# Altium schematic sheet STM-Board-v1.0.SchDoc
size 454 x 193 mm; Date: 10.02.2021; ApprovedBy: Еремеев И.М.; CheckedBy: Ямщиков А.В.; Author: Мухарялмов И.Г.; CompanyName: ООО "Промобот"; City: г.Пермь,; Mail: mig@promo-bot.ru; Project Version: RoboC 0.8.2; Project: RoboC; Document: Принципиальная схема; Hardware version: 0.8
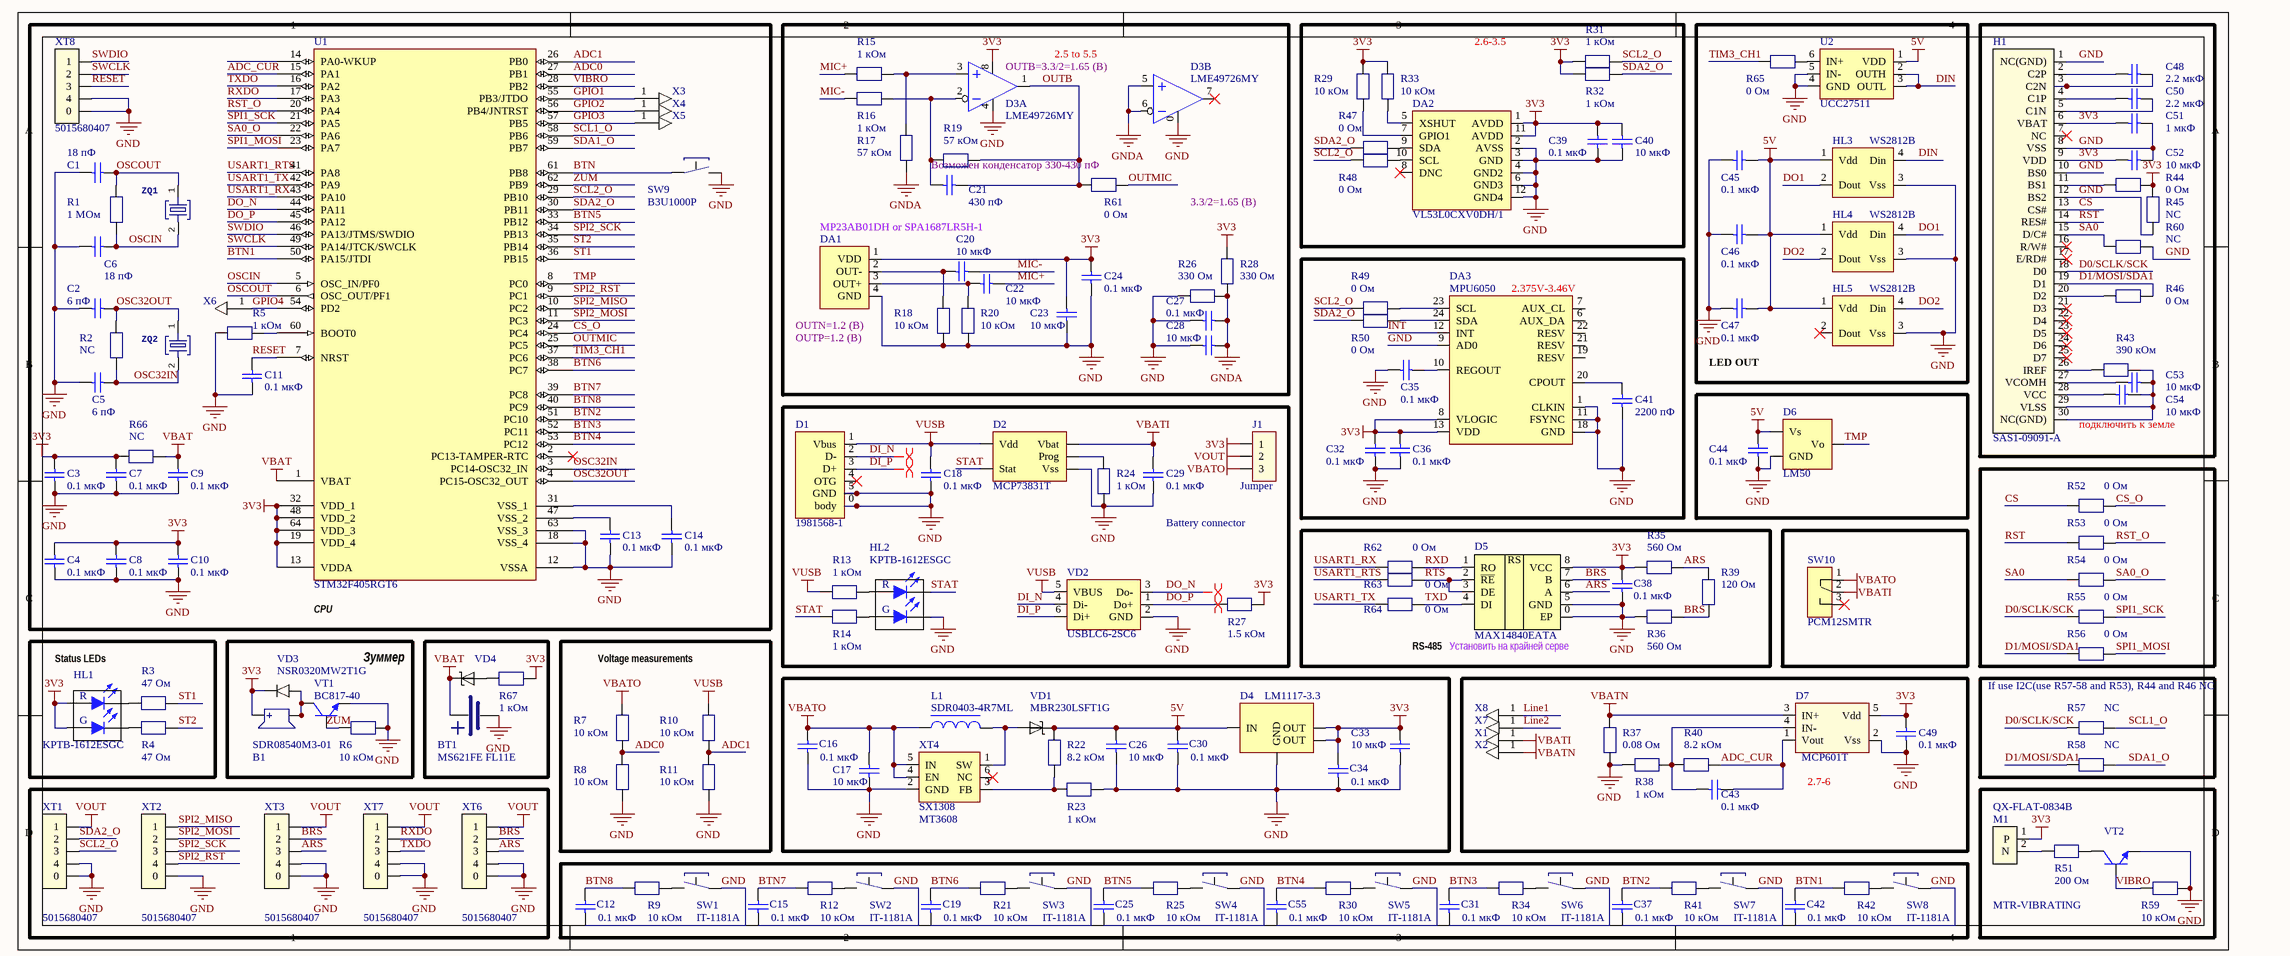
[diagram p0: STM-Board-v1.0.SchDoc]

## Parts
B1  SDR08540M3-01  [SDR08540M3-01]
BT1  MS621FE FL11E  [MS621FE FL11E]
C1  value 18 пФ  [C0402]  (hidden comment: Capacitor)
C2  value 6 пФ  [C0402]  (hidden comment: Capacitor)
C3  value 0.1 мкФ  [C0402]  (hidden comment: Capacitor)
C4  value 0.1 мкФ  [C0402]  (hidden comment: Capacitor)
C5  value 6 пФ  [C0402]  (hidden comment: Capacitor)
C6  value 18 пФ  [C0402]  (hidden comment: Capacitor)
C7  value 0.1 мкФ  [C0402]  (hidden comment: Capacitor)
C8  value 0.1 мкФ  [C0402]  (hidden comment: Capacitor)
C9  value 0.1 мкФ  [C0402]  (hidden comment: Capacitor)
C10  value 0.1 мкФ  [C0402]  (hidden comment: Capacitor)
C11  value 0.1 мкФ  [C0402]  (hidden comment: Capacitor)
C12  value 0.1 мкФ  [C0402]  (hidden comment: Capacitor)
C13  value 0.1 мкФ  [C0402]  (hidden comment: Capacitor)
C14  value 0.1 мкФ  [C0402]  (hidden comment: Capacitor)
C15  value 0.1 мкФ  [C0402]  (hidden comment: Capacitor)
C16  value 0.1 мкФ  [C0402]  (hidden comment: Capacitor)
C17  value 10 мкФ  [1206]  (hidden comment: Capacitor)
C18  value 0.1 мкФ  [C0402]  (hidden comment: Capacitor)
C19  value 0.1 мкФ  [C0402]  (hidden comment: Capacitor)
C20  value 10 мкФ  [C0402]  (hidden comment: Capacitor)
C21  value 430 пФ  [C0402]  (hidden comment: Capacitor)
C22  value 10 мкФ  [C0402]  (hidden comment: Capacitor)
C23  value 10 мкФ  [C0402]  (hidden comment: Capacitor)
C24  value 0.1 мкФ  [C0402]  (hidden comment: Capacitor)
C25  value 0.1 мкФ  [C0402]  (hidden comment: Capacitor)
C26  value 10 мкФ  [1206]  (hidden comment: Capacitor)
C27  value 0.1 мкФ  [C0402]  (hidden comment: Capacitor)
C28  value 10 мкФ  [C0402]  (hidden comment: Capacitor)
C29  value 0.1 мкФ  [C0402]  (hidden comment: Capacitor)
C30  value 0.1 мкФ  [C0402]  (hidden comment: Capacitor)
C31  value 0.1 мкФ  [C0402]  (hidden comment: Capacitor)
C32  value 0.1 мкФ  [C0402]  (hidden comment: Capacitor)
C33  value 10 мкФ  [1206]  (hidden comment: Capacitor)
C34  value 0.1 мкФ  [C0402]  (hidden comment: Capacitor)
C35  value 0.1 мкФ  [C0402]  (hidden comment: Capacitor)
C36  value 0.1 мкФ  [C0402]  (hidden comment: Capacitor)
C37  value 0.1 мкФ  [C0402]  (hidden comment: Capacitor)
C38  value 0.1 мкФ  [C0402]  (hidden comment: Capacitor)
C39  value 0.1 мкФ  [C0402]  (hidden comment: Capacitor)
C40  value 10 мкФ  [C0402]  (hidden comment: Capacitor)
C41  value 2200 пФ  [C0402]  (hidden comment: Capacitor)
C42  value 0.1 мкФ  [C0402]  (hidden comment: Capacitor)
C43  value 0.1 мкФ  [C0402]  (hidden comment: Capacitor)
C44  value 0.1 мкФ  [C0402]  (hidden comment: Capacitor)
C45  value 0.1 мкФ  [C0402]  (hidden comment: Capacitor)
C46  value 0.1 мкФ  [C0402]  (hidden comment: Capacitor)
C47  value 0.1 мкФ  [C0402]  (hidden comment: Capacitor)
C48  value 2.2 мкФ  [C0402]  (hidden comment: Capacitor)
C49  value 0.1 мкФ  [C0402]  (hidden comment: Capacitor)
C50  value 2.2 мкФ  [C0402]  (hidden comment: Capacitor)
C51  value 1 мкФ  [C0402]  (hidden comment: Capacitor)
C52  value 10 мкФ  [C0402]  (hidden comment: Capacitor)
C53  value 10 мкФ  [C0402]  (hidden comment: Capacitor)
C54  value 10 мкФ  [C0402]  (hidden comment: Capacitor)
C55  value 0.1 мкФ  [C0402]  (hidden comment: Capacitor)
D1  1981568-1  [MicroUSB-B]
D2  MCP73831T  [SOT23-5]
D3  value LME49726MY  [MSOP8 - PP]  (hidden comment: Audio Operational Amplifier)  (parts A,B of 2)
D4  LM1117-3.3  [SOT223]
D5  MAX14840EATA  [TDFN-8]
D6  value LM50  [SOT-23]  (hidden comment: Датчик температуры)
D7  value MCP601T  [SOT23-5]  (hidden comment: Операционный усилитель)
DA1  MP23AB01DH or SPA1687LR5H-1  [MP23AB01DH]
DA2  value VL53L0CXV0DH/1  [VL53L0X - big]  (hidden comment: ИК датчик VL53L0X)
DA3  value MPU6050  [MPU-6050]  (hidden comment: Гироскоп)
H1  value SAS1-09091-A  [OLED 1.3 128x64]  (hidden comment: OLED DIsp 1.3 128x64)
HL1  KPTB-1612ESGC  [LED_1.6x1.25]
HL2  KPTB-1612ESGC  [LED_1.6x1.25]
HL3  WS2812B  [WS2812B_N]
HL4  WS2812B  [WS2812B_N]
HL5  WS2812B  [WS2812B_N]
J1  value Jumper  [Jumper_3]  (hidden comment: Jumper_2)
L1  SDR0403-4R7ML  [SDR0403]
M1  QX-FLAT-0834B  [QX-FLAT-0834B]
R1  value 1 МОм  [R0402]  (hidden comment: Чип резистор)
R2  value NC  [R0402]  (hidden comment: Чип резистор)
R3  value 47 Ом  [R0402]  (hidden comment: Чип резистор 0402)
R4  value 47 Ом  [R0402]  (hidden comment: Чип резистор 0402)
R5  value 1 кОм  [R0402]  (hidden comment: Чип резистор)
R6  value 10 кОм  [R0402]  (hidden comment: Чип резистор)
R7  value 10 кОм  [R0402]  (hidden comment: Чип резистор)
R8  value 10 кОм  [R0402]  (hidden comment: Чип резистор)
R9  value 10 кОм  [R0402]  (hidden comment: Чип резистор)
R10  value 10 кОм  [R0402]  (hidden comment: Чип резистор)
R11  value 10 кОм  [R0402]  (hidden comment: Чип резистор)
R12  value 10 кОм  [R0402]  (hidden comment: Чип резистор)
R13  1 кОм  [R0402]
R14  1 кОм  [R0402]
R15  value 1 кОм  [R0402]  (hidden comment: Чип резистор)
R16  value 1 кОм  [R0402]  (hidden comment: Чип резистор)
R17  value 57 кОм  [R0402]  (hidden comment: Чип резистор)
R18  value 10 кОм  [R0402]  (hidden comment: Чип резистор)
R19  value 57 кОм  [R0402]  (hidden comment: Чип резистор)
R20  value 10 кОм  [R0402]  (hidden comment: Чип резистор)
R21  value 10 кОм  [R0402]  (hidden comment: Чип резистор)
R22  8.2 кОм  [R0402]
R23  1 кОм  [R0402]
R24  value 1 кОм  [R0402]  (hidden comment: Чип резистор)
R25  value 10 кОм  [R0402]  (hidden comment: Чип резистор)
R26  value 330 Ом  [R0402]  (hidden comment: Чип резистор)
R27  value 1.5 кОм  [R0402]  (hidden comment: Чип резистор)
R28  value 330 Ом  [R0402]  (hidden comment: Чип резистор)
R29  value 10 кОм  [R0402]  (hidden comment: Чип резистор)
R30  value 10 кОм  [R0402]  (hidden comment: Чип резистор)
R31  value 1 кОм  [R0402]  (hidden comment: Чип резистор)
R32  value 1 кОм  [R0402]  (hidden comment: Чип резистор)
R33  value 10 кОм  [R0402]  (hidden comment: Чип резистор)
R34  value 10 кОм  [R0402]  (hidden comment: Чип резистор)
R35  value 560 Ом  [R0402]  (hidden comment: Чип резистор)
R36  value 560 Ом  [R0402]  (hidden comment: Чип резистор)
R37  value 0.08 Ом  [P1206]  (hidden comment: Чип резистор)
R38  value 1 кОм  [R0402]  (hidden comment: Чип резистор)
R39  value 120 Ом  [R0402]  (hidden comment: Чип резистор)
R40  value 8.2 кОм  [R0402]  (hidden comment: Чип резистор)
R41  value 10 кОм  [R0402]  (hidden comment: Чип резистор)
R42  value 10 кОм  [R0402]  (hidden comment: Чип резистор)
R43  value 390 кОм  [R0402]  (hidden comment: Чип резистор)
R44  value 0 Ом  [R0402]  (hidden comment: Чип резистор)
R45  value NC  [R0402]  (hidden comment: Чип резистор)
R46  value 0 Ом  [R0402]  (hidden comment: Чип резистор)
R47  value 0 Ом  [R0402]  (hidden comment: Чип резистор)
R48  value 0 Ом  [R0402]  (hidden comment: Чип резистор)
R49  value 0 Ом  [R0402]  (hidden comment: Чип резистор)
R50  value 0 Ом  [R0402]  (hidden comment: Чип резистор)
R51  value 200 Ом  [R0402]  (hidden comment: Чип резистор)
R52  value 0 Ом  [R0402]  (hidden comment: Чип резистор)
R53  value 0 Ом  [R0402]  (hidden comment: Чип резистор)
R54  value 0 Ом  [R0402]  (hidden comment: Чип резистор)
R55  value 0 Ом  [R0402]  (hidden comment: Чип резистор)
R56  value 0 Ом  [R0402]  (hidden comment: Чип резистор)
R57  value NC  [R0402]  (hidden comment: Чип резистор)
R58  value NC  [R0402]  (hidden comment: Чип резистор)
R59  value 10 кОм  [R0402]  (hidden comment: Чип резистор)
R60  value NC  [R0402]  (hidden comment: Чип резистор)
R61  value 0 Ом  [R0402]  (hidden comment: Чип резистор)
R62  value 0 Ом  [R0402]  (hidden comment: Чип резистор)
R63  value 0 Ом  [R0402]  (hidden comment: Чип резистор)
R64  value 0 Ом  [R0402]  (hidden comment: Чип резистор)
R65  value 0 Ом  [R0402]  (hidden comment: Чип резистор)
R66  value NC  [R0402]  (hidden comment: Чип резистор)
R67  value 1 кОм  [R0402]  (hidden comment: Чип резистор)
SW1  IT-1181A  [SWT-1]
SW2  IT-1181A  [SWT-1]
SW3  IT-1181A  [SWT-1]
SW4  IT-1181A  [SWT-1]
SW5  IT-1181A  [SWT-1]
SW6  IT-1181A  [SWT-1]
SW7  IT-1181A  [SWT-1]
SW8  IT-1181A  [SWT-1]
SW9  B3U1000P  [B3U1000P]
SW10  PCM12SMTR  [PCM12SMTR]
U1  value STM32F405RGT6  [LQFP64_L]  (hidden comment: STM32F302RCT6)
U2  UCC27511  [SOT23-6]
VD1  MBR230LSFT1G  [SOD-123]
VD2  USBLC6-2SC6  [SOT23-6]
VD3  NSR0320MW2T1G  [SOD-323]
VD4  NSR0320MW2T1G  [SOD-323]  (value not drawn)
VT1  ВС817-40  [SOT-23]
VT2  ВС817-40  [SOT-23]  (value not drawn)
X1  (no value)  [PAD_1X2]
X2  (no value)  [PAD_1X2]
X3  (no value)  [Pad_R2]
X4  (no value)  [Pad_R2]
X5  (no value)  [Pad_R2]
X6  (no value)  [Pad_R2]
X7  (no value)  [Pad_R2]
X8  (no value)  [Pad_R2]
XT1  5015680407  [5015680407]
XT2  5015680407  [5015680407]
XT3  5015680407  [5015680407]
XT4  SX1308  [SOT23-6]
XT6  5015680407  [5015680407]
XT7  5015680407  [5015680407]
XT8  5015680407  [5015680407]
ZQ1  ABM3-8.000MHZ-D2Y-T  [ABM3]  (value not drawn)
ZQ2  ABS07-120-32.768KHZ-T  [ABS07]  (value not drawn)

## Blocks framed on the sheet
CPU: C1-C11 C13 C14 R1 R2 R5 R66 SW9 U1 X3-X6 XT8 ZQ1 ZQ2
2.6-3.5: C39 C40 DA2 R29 R31-R33 R47 R48
LED OUT: C45-C47 HL3-HL5 R65 U2
подключить к земле: C48 C50-C54 H1 R43-R46 R60
2.375V-3.46V: C32 C35 C36 C41 DA3 R49 R50
Battery connector: C18 C29 D1 D2 HL2 J1 R13 R14 R24 R27 VD2
Status LEDs: HL1 R3 R4
Зуммер: B1 R6 VD3 VT1
Voltage measurements: R7 R8 R10 R11
MT3608: C16 C17 C26 C30 C33 C34 D4 L1 R22 R23 VD1 XT4
2.7-6: C43 C49 D7 R37 R38 R40 X1 X2 X7 X8
If use I2C(use R57-58 and R53), R44 and R46 NC: R57 R58
MTR-VIBRATING: M1 R51 R59 VT2

## Nets
3V3: B1.1(+) C3.1 C4.1 C7.1 C8.1 C10.1 C23.2 C24.2 C32.1 C33.2 C34.2 C36.1 C38.2 C39.1 C40.1 C49.1 C51.1 C52.1 D3.8(Vcc) D4.2(OUT) D4.4(OUT) D5.8(VCC) D7.5(Vdd) DA1.1(VDD) DA2.1(AVDD) DA2.11(AVDD) DA3.8(VLOGIC) DA3.13(VDD) H1.6(VBAT) H1.9(VDD) HL1.1(A) HL1.3(A) J1.1 M1.1(P) R27.2 R28.2 R29.2 R31.2 R32.2 R33.2 R35.2 R44.1 R45.1 R66.1 R67.1 U1.13(VDDA) U1.19(VDD_4) U1.32(VDD_1) U1.48(VDD_2) U1.64(VDD_3) VD3.1(K)
5V: C26.2 C30.2 C44.1 C45.2 C46.2 C47.2 D4.3(IN) D6.1(Vs) HL3.1(Vdd) HL4.1(Vdd) HL5.1(Vdd) R22.1 U2.1(VDD) VD1.1(K)
GND: BT1.2(-) C1.1 C2.1 C3.2 C4.2 C5.1 C6.1 C7.2 C8.2 C9.2 C10.2 C11.2 C12.1 C13.2 C14.2 C15.1 C16.1 C17.1 C18.1 C19.1 C23.1 C24.1 C25.1 C26.1 C27.2 C28.2 C29.1 C30.1 C31.1 C32.2 C33.1 C34.1 C35.1 C36.2 C37.1 C38.1 C39.2 C40.2 C41.2 C42.1 C44.2 C45.1 C46.1 C47.1 C49.2 C51.2 C52.2 C55.1 D1.0(body) D1.5(GND) D2.2(Vss) D3.0(PP) D3.4(GND) D4.1(GND) D5.0(EP) D5.5(GND) D6.3(GND) D7.2(Vss) DA1.4(GND) DA2.2(AVSS) DA2.3(GND) DA2.4(GND2) DA2.6(GND3) DA2.12(GND4) DA3.1(CLKIN) DA3.9(AD0) DA3.11(FSYNC) DA3.18(GND) H1.1(NC(GND)) H1.8(VSS) H1.10(BS0) H1.12(BS2) HL2.4(C) HL3.3(Vss) HL4.3(Vss) HL5.3(Vss) R5.2 R6.1 R8.2 R11.2 R18.2 R20.2 R23.2 R24.1 R26.1 R36.2 R37.2 R38.2 R45.2 R59.2 R60.1 SW1.1 SW2.1 SW3.1 SW4.1 SW5.1 SW6.1 SW7.1 SW8.1 SW9.2 U1.12(VSSA) U1.18(VSS_4) U1.63(VSS_3) U2.4(GND) U2.5(IN-) VD2.2(GND) VT1.2(E) VT2.2(E) XT1.0 XT1.4 XT2.0 XT3.0 XT3.4 XT4.2(GND) XT6.0 XT6.4 XT7.0 XT7.4 XT8.0 XT8.4
GNDA: C27.1 C28.1 D3.5(2IN+) D3.6(2IN-) R17.1 R26.2 R28.1
VBAT: BT1.1(+) C9.1 R66.2 U1.1(VBAT) VD4.1(K)
VBATI: C29.2 D2.3(Vbat) SW10.2 X1.1
VBATN: D7.3(IN+) R37.1 X2.1
VBATO: C16.2 C17.2 J1.3 L1.1 R7.1 SW10.1 XT4.4(EN) XT4.5(IN)
VOUT: J1.2 XT1.1 XT3.1 XT6.1 XT7.1
VUSB: C18.2 D1.1(Vbus) D2.4(Vdd) R10.1 R13.1 VD2.5(VBUS)
ADC0: R7.2 R8.1 U1.27(PB1)
ADC1: R10.2 R11.1 U1.26(PB0)
ADC_CUR: C43.1 D7.1(Vout) R40.1 U1.15(PA1)
ARS: D5.6(A) R35.1 R39.1 XT3.3 XT6.3
BRS: D5.7(B) R36.1 R39.2 XT3.2 XT6.2
BTN: SW9.1 U1.61(PB8)
BTN1: C42.2 R42.1 U1.50(PA15/JTDI)
BTN2: C37.2 R41.1 U1.51(PC10)
BTN3: C31.2 R34.1 U1.52(PC11)
BTN4: C55.2 R30.1 U1.53(PC12)
BTN5: C25.2 R25.1 U1.33(PB12)
BTN6: C19.2 R21.1 U1.38(PC7)
BTN7: C15.2 R12.1 U1.39(PC8)
BTN8: C12.2 R9.1 U1.40(PC9)
CS: H1.13(CS#) R52.2
CS_O: R52.1 U1.24(PC4)
D0/SCLK/SCK: H1.18(D0) R55.2 R57.2
D1/MOSI/SDA1: H1.19(D1) R46.1 R56.2 R58.2
DI_N: D1.2(D-) VD2.4(Di-)
DI_P: D1.3(D+) VD2.6(Di+)
DIN: HL3.4(Din) U2.2(OUTH) U2.3(OUTL)
DO1: HL3.2(Dout) HL4.4(Din)
DO2: HL4.2(Dout) HL5.4(Din)
DO_N: U1.44(PA11) VD2.3(Do-)
DO_P: R27.1 U1.45(PA12) VD2.1(Do+)
GPIO1: U1.55(PB3/JTDO) X3.1
GPIO2: U1.56(PB4/JNTRST) X4.1
GPIO3: U1.57(PB5) X5.1
GPIO4: U1.54(PD2) X6.1
INT: DA3.12(INT)
Line1: X8.1
Line2: X7.1
MIC+: C22.1 R15.1
MIC-: C20.1 R16.1
OSC32IN: C5.2 R2.2 U1.3(PC14-OSC32_IN) ZQ2.2
OSC32OUT: C2.2 R2.1 U1.4(PC15-OSC32_OUT) ZQ2.1
OSCIN: C6.2 R1.1 U1.5(OSC_IN/PF0) ZQ1.2
OSCOUT: C1.2 R1.2 U1.6(OSC_OUT/PF1) ZQ1.1
OUTB: C21.1 D3.1(1OUT) R19.2 R61.2
OUTMIC: R61.1 U1.25(PC5)
RESET: C11.1 U1.7(NRST) XT8.3
RST: H1.14(RES#) R53.2
RST_O: R53.1 U1.20(PA4)
RTS: D5.2(~{RE}) D5.3(DE) R63.1
RXD: D5.1(RO) R62.1
RXDO: U1.17(PA3) XT7.2
SA0: H1.15(D/C#) R54.2 R60.2
SA0_O: R54.1 U1.22(PA6)
SCL1_O: R57.1 U1.58(PB6)
SCL2_O: R31.1 R48.2 R49.2 U1.29(PB10) XT1.3
SDA1_O: R58.1 U1.59(PB7)
SDA2_O: R32.1 R47.2 R50.2 U1.30(PB11) XT1.2
SPI1_MOSI: R56.1 U1.23(PA7)
SPI1_SCK: R55.1 U1.21(PA5)
SPI2_MISO: U1.10(PC2) XT2.1
SPI2_MOSI: U1.11(PC3) XT2.2
SPI2_RST: U1.9(PC1) XT2.4
SPI2_SCK: U1.34(PB13) XT2.3
ST1: R3.2 U1.36(PB15)
ST2: R4.2 U1.35(PB14)
STAT: D2.1(Stat) HL2.2(C) R14.1
SWCLK: U1.49(PA14/JTCK/SWCLK) XT8.2
SWDIO: U1.46(PA13/JTMS/SWDIO) XT8.1
TIM3_CH1: R65.2 U1.37(PC6)
TMP: D6.2(Vo) U1.8(PC0)
TXD: D5.4(DI) R64.1
TXDO: U1.16(PA2) XT7.3
USART1_RTS: R63.2 U1.41(PA8)
USART1_RX: R62.2 U1.43(PA10)
USART1_TX: R64.2 U1.42(PA9)
VIBRO: R59.1 U1.28(PB2) VT2.1(B)
ZUM: R6.2 U1.62(PB9) VT1.1(B)
NetB1_2: B1.2(-) B1.3(-) B1.4(-) VD3.2(A) VT1.3(C)
NetC13_1: C13.1 U1.47(VSS_2)
NetC14_1: C14.1 U1.31(VSS_1)
NetC20_2: C20.2 DA1.2(OUT-) R18.1
NetC21_2: C21.2 D3.2(1IN-) R16.2 R19.1
NetC22_2: C22.2 DA1.3(OUT+) R20.1
NetC35_2: C35.2 DA3.10(REGOUT)
NetC41_1: C41.1 DA3.20(CPOUT)
NetC43_2: C43.2 D7.4(IN-) R38.1 R40.2
NetC48_1: C48.1 H1.2(C2P)
NetC48_2: C48.2 H1.3(C2N)
NetC50_1: C50.1 H1.4(C1P)
NetC50_2: C50.2 H1.5(C1N)
NetC53_1: C53.1 H1.27(VCOMH)
NetC53_2: C53.2 C54.2 H1.29(VLSS) H1.30(NC(GND)) R43.1
NetC54_1: C54.1 H1.28(VCC)
NetD2_5: D2.5(Prog) R24.2
NetD3_3: D3.3(1IN+) R15.2 R17.2
NetDA2_5: DA2.5(XSHUT) R33.1
NetDA2_7: DA2.7(GPIO1) R29.1
NetDA2_9: DA2.9(SDA) R47.1
NetDA2_10: DA2.10(SCL) R48.1
NetDA3_23: DA3.23(SCL) R49.1
NetDA3_24: DA3.24(SDA) R50.1
NetH1_11: H1.11(BS1) R44.2
NetH1_20: H1.20(D2) R46.2
NetH1_26: H1.26(IREF) R43.2
NetHL1_2: HL1.2(C) R3.1
NetHL1_4: HL1.4(C) R4.1
NetHL2_1: HL2.1(A) R13.2
NetHL2_3: HL2.3(A) R14.2
NetL1_2: L1.2 VD1.2(A) XT4.1(SW)
NetM1_2: M1.2(N) R51.1
NetR5_1: R5.1 U1.60(BOOT0)
NetR9_2: R9.2 SW1.2
NetR12_2: R12.2 SW2.2
NetR21_2: R21.2 SW3.2
NetR22_2: R22.2 R23.1 XT4.3(FB)
NetR25_2: R25.2 SW4.2
NetR30_2: R30.2 SW5.2
NetR34_2: R34.2 SW6.2
NetR41_2: R41.2 SW7.2
NetR42_2: R42.2 SW8.2
NetR51_2: R51.2 VT2.3(C)
NetR65_1: R65.1 U2.6(IN+)
NetR67_2: R67.2 VD4.2(A)

Not connected (* = marked no-connect by the designer): D1 4(OTG)*; D3 7(2OUT)*; DA2 8(DNC)*; DA3 6(AUX_DA) 7(AUX_CL) 19(RESV) 21(RESV) 22(RESV); H1 7(NC)* 16(R/W#)* 17(E/RD#)* 21(D3)* 22(D4)* 23(D5)* 24(D6)* 25(D7)*; HL5 2(Dout)*; SW10 3*; U1 2(PC13-TAMPER-RTC)* 14(PA0-WKUP); XT4 6(NC)*

## Layout directives
differential pair: DI_N, DI_P, DO_N, DO_P

## Notes on the sheet
- (near D3) OUTB=3.3/2=1.65 (В)
- (near D3) 2.5 to 5.5
- (near R19) Возможен конденсатор 330-430 пФ
- 3.3/2=1.65 (В)
- (near DA1) OUTN=1.2 (В)
- (near DA1) OUTP=1.2 (В)
- (near R24) Charge Complete –
  Standby STATE = HIGH
- RS-485
- (near D5) Установить на крайней серве
- Title
- Size:
- Date:
- File:
- A1
- Number:
- Time:
- Revision:
- Sheet
- of
- (in symbol LED_x2_RG) R; G
- (in symbol MAX14840) RS

## Library data of the parts
B1 = SDR08540M3-01: SP: Зуммер; Value: SDR08540M3-01
BT1 = Battery RTC: SP: Battery RTC; Value: MS621FE FL11E
C1-C55 = Capacitor: Чип конденсатор 0805; SP: Чип конденсатор
D1 = USB_micro: micro; SP: MicroUSB; Value: 1981568-1
D2 = MCP73831: SP: Контроллер заряда батарей; Value: MCP73831T-2ACI/OT
D3 = LME49726: Comparators; SP: Audio Operational Amplifier
D4 = LM1117: SP: DC-DC Line; Value: LM1117-3.3
D5 = MAX14840: RS-485; SP: Half-Duplex Transceivers; Value: MAX14840EATA
D6 = LM50: Temperatury sensors; SP: Датчик температуры
D7 = MCP601T: SP: Операционный усилитель
DA1 = MP23AB01DH: SP: MEMS MIC; Value: MP23AB01DH or SPA1687LR5H-1
DA2 = VL53L0X: SP: ИК датчик VL53L0X
DA3 = MPU6050: SP: Гироскоп
H1 = OLED_1.3_128x64: 1.3in OLED 128x64  SAS1-09091-A; SP: OLED DIsp 1.3 128x64
HL1 HL2 = LED_x2_RG: SP: Светодиод 1.6x1.25; Value: KPTB-1612ESGC
HL3-HL5 = WS2812B: SP: Intelligent control LED; Value: WS2812B
J1 = Jumper_2: Jumper; SP: Перемычка
L1 = inductor: SP: Чип индуктивность 4.7 мкГн; Value: SDR0403-4R7ML
M1 = QX-FLAT-0834B: VIBRATING; SP: VIBRATING; Value: QX-FLAT-0834B
R1-R12 R15-R21 R24-R67 = Resistor
  R1 R2 R5-R12 R15-R21 R24-R67: SP: Чип резистор
  R3 R4: SP: Чип резистор 0402
R13 R14 R22 R23 = R0402: Чип резистор 0402; SP: Чип резистор 0402
  R13 R14 R23: Value: 1 кОм
  R22: Value: 8.2 кОм
SW1-SW8 = SWT-1-1: SP: Button; Value: IT-1181A
SW9 = SWT-1_1: SP: Button; Value: B3U1000P
SW10 = PCM12SMTR: SP: Switch 3 pin; Value: PCM12SMTR
U1 = STM32F302R: STM32 ARM-Cortex M3 32-bit MCU, 128 kB; SP: Микроконтроллер (LQFP64)
U2 = UCC27511: SP: Low-Side Gate Driver; Value: UCC27511
VD1 VD4 = MBR120LSFT1G: Diod schottki; SP: Диод Шоттки  MBR120LSFT1G
VD2 = USBLC6-2SC6: ESD; SP: ESD protection; Value: USBLC6-2SC6
VD3 = diode: Диод; SP: Diode; Value: NSR0320MW2T1G
VT1 VT2 = BC817-40: BC817-40 NPN Транзистор; SP: Транзистор NPN; Value: ВС817-40
X1-X8 = Pad
XT1-XT3 XT6-XT8 = 5015680407: molex; SP: Connector 4 pin; Value: 5015680407
XT4 = SX1308: DC-DC Step_Up; SP: Step up converter; Value: SX1308
ZQ1 = ABM3: SMD Quartz; SP: Crystals 8 MHz; Value: ABM3-8.000MHZ-D2Y-T
ZQ2 = ABM3: SMD Quartz; SP: ABS07 32 МГц; Value: ABS07-120-32.768KHZ-T